# EAGLE design pci_fonte (EAGLE 9.6.2)
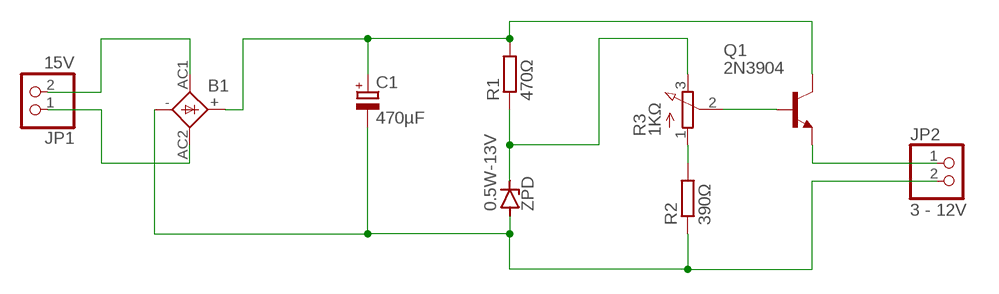
[diagram p0: schematic, sheet 1]

## Parts
0.5W-13V  ZPD  [DO35Z10]
B1  1KAB  [1KAB]
C1  470µF  CPOL-EUE3.5-10  [E3,5-10]
JP1  15V  PINHD-1X2  [1X02]
JP2  3 - 12V  PINHD-1X2  [1X02]
Q1  2N3904  [TO92]
R1  470Ω  R-EU_0204/7  [0204/7]
R2  390Ω  R-EU_0204/7  [0204/7]
R3  1KΩ  3RP/1610N  [3RP/1610N]

## Nets
N$1: B1.AC1 JP1.2
N$2: B1.AC2 JP1.1
N$3: B1.+ C1.+ Q1.1(C) R1.2
N$5: Q1.2(B) R3.2(S)
N$6: 0.5W-13V.C R1.1 R3.3(E)
N$7: JP2.1 Q1.3(E)
N$8: R2.2 R3.1(A)
N$9: 0.5W-13V.A B1.- C1.- JP2.2 R2.1

## Library data of the parts
0.5W-13V = diode:ZPD: Z DIODE 500 mW
B1 = rectifier:1KAB: RECTIFIER grid 5,08 x 5,08 mm
C1 = rcl:CPOL-EU: POLARIZED CAPACITOR, European symbol; SPICEPREFIX: C
JP1 JP2 = pinhead:PINHD-1X2: PIN HEADER
Q1 = transistor-npn:2N3904: NPN Transistor
R1 R2 = rcl:R-EU_: RESISTOR, European symbol; SPICEPREFIX: R
R3 = pot:3RP/1610N: 16mm Potentiometer one level Source: http://www.alphapotentiometers.net/html/16mm_pot_2.html

## Board
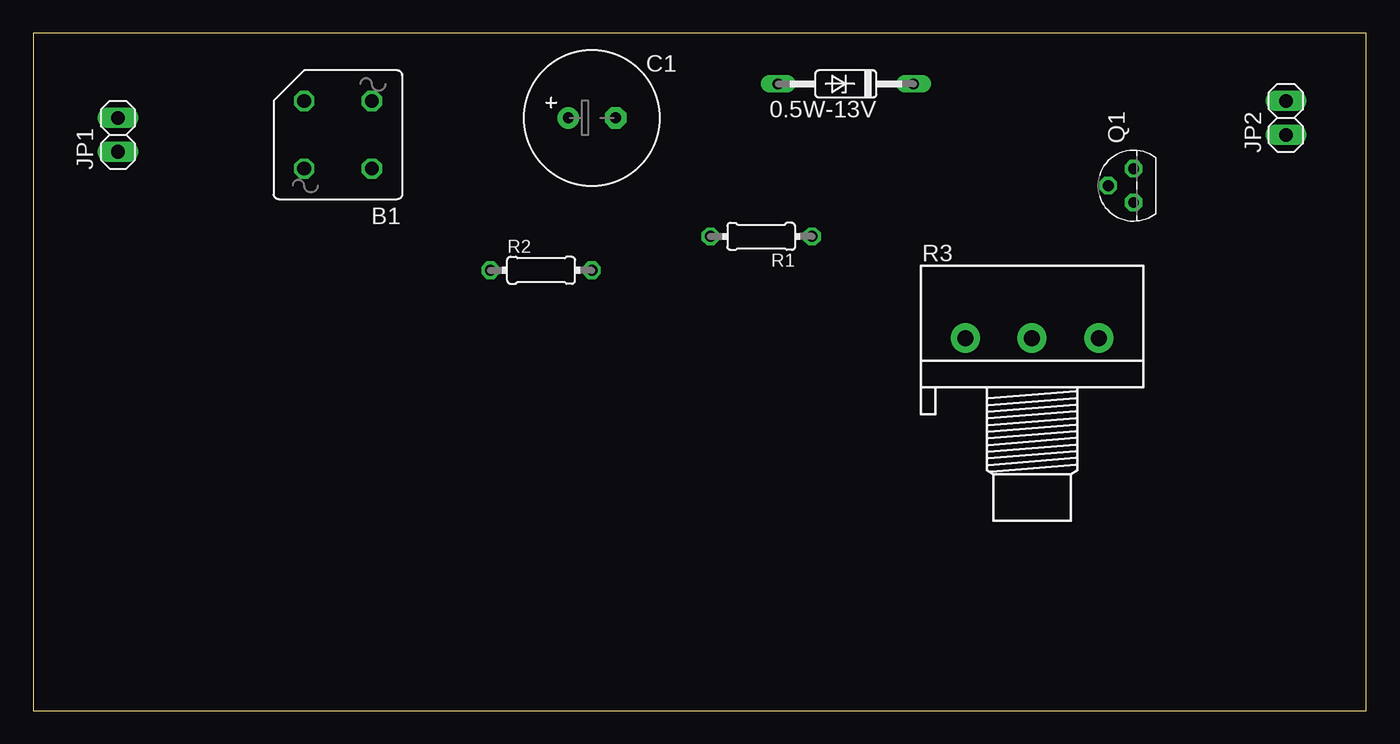
[diagram p1: board, top side]
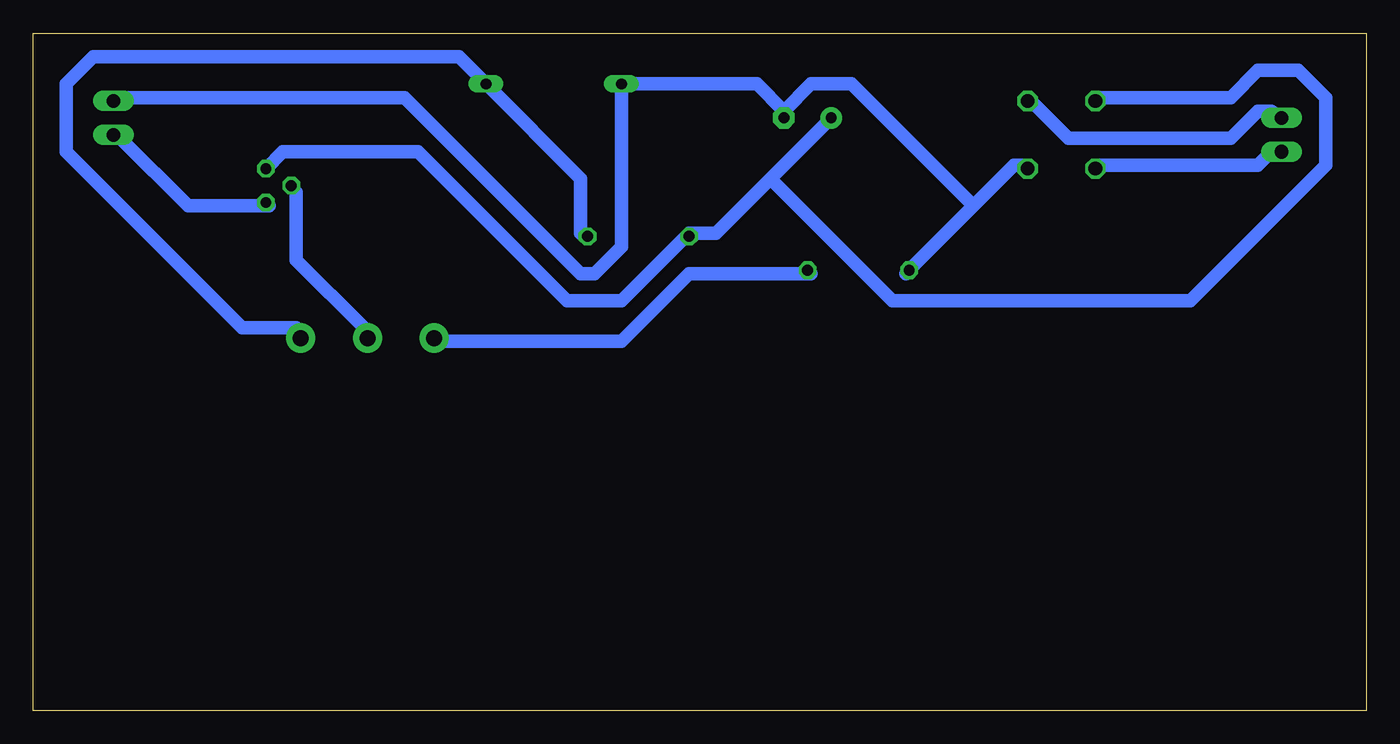
[diagram p2: board, bottom side, seen from below]

Size 100 x 50.79 mm. Coordinates in mm from the lower left corner, seen from the top.
Outline: 0,0 100,0 100,50.79 0,50.79 0,0
Copper layers (1*16): Top 0.035mm / dielectric 1.5mm / Bottom 0.035mm
Design rules "default *": minimum track width 40mil, minimum drill 0.35mm, track to track 40mil, track to pad 40mil, pad to pad 40mil, via to via 40mil, smd to smd 6mil, copper to edge 40mil, drill to drill 6mil, minimum pad ring 10mil, minimum via ring 8mil, stop-mask expansion 4mil, vias tented up to drill 0mil, thermal gap 10mil

### Footprints (pad centres in the part's own frame; a part is rotated, then mirrored left to right if it is on the bottom)
DO35Z10 = drill 0.813 long: A 5.08,0; C -5.08,0
1KAB = drill 1.016 octagon: + 2.54,-2.54; - -2.54,2.54; AC1 -2.54,-2.54; AC2 2.54,2.54
E3,5-10 = drill 0.813 pad 1.6: + -1.778,0 | drill 0.813 pad 1.6 octagon: - 1.778,0
1X02 = drill 1.016 long: 1 -1.27,0; 2 1.27,0
TO92 = drill 0.813 octagon: 1 1.27,0; 2 0,1.905; 3 -1.27,0
0204/7 = drill 0.813 octagon: 1 -3.81,0; 2 3.81,0
3RP/1610N = drill 1.2 pad 2.184: 1 -5,0; 2 0,0; 3 5,0

### Placement (x,y rotation side)
0.5W-13V  60.96,46.99 180 top
B1  22.86,43.18 180 top
C1  41.91,44.45 0 top
JP1  6.35,43.18 90 top
JP2  93.98,44.45 90 top
Q1  82.55,39.37 90 top
R1  54.61,35.56 180 top
R2  38.1,33.02 0 top
R3  74.93,27.94 0 top

### Tracks (layer width: path | path; a pad name or v marks a point on that pad's centre or on a via)
N$1
  Bottom 1.016: JP1.2 7.11,44.96 8.13,44.96 10.16,42.93 22.35,42.93 25.4,45.97 B1.AC1
N$2
  Bottom 1.016: B1.AC2 20.32,40.89 8.13,40.89 7.11,41.91 JP1.1
N$3
  Bottom 1.016: 50.8,35.81 48.77,35.81 44.7,39.88 | C1.+ 44.7,39.88 | Q1.1 81.28,41.91 71.12,41.91 59.94,30.73 55.88,30.73 50.8,35.81 | 50.8,35.81 R1.2 | 44.7,39.88 35.56,30.73 13.21,30.73 3.05,40.89 3.05,45.97 5.08,48.01 8.13,48.01 10.16,45.97 20.32,45.97 B1.+
N$5
  Bottom 1.016: Q1.2 80.26,38.86 80.26,33.78 75.18,28.7 R3.2
N$6
  Bottom 1.016: R1.1 58.93,35.81 58.93,39.88 0.5W-13V.C 68.07,49.02 95.5,49.02 97.54,46.99 97.54,41.91 84.33,28.7 80.26,28.7 R3.3
N$7
  Bottom 1.016: Q1.3 82.3,37.85 88.39,37.85 93.47,42.93 JP2.1
N$8
  Bottom 1.016: R2.2 41.66,32.77 50.8,32.77 55.88,27.69 69.09,27.69 R3.1
N$9
  Bottom 1.016: 29.46,37.85 26.42,40.89 25.4,40.89 B1.- | 29.46,37.85 R2.1 34.54,32.77 | 43.69,44.96 45.72,46.99 0.5W-13V.A 55.88,34.8 57.91,32.77 58.93,32.77 72.14,45.97 93.47,45.97 JP2.2 | 29.46,37.85 38.61,46.99 41.66,46.99 43.69,44.96 | 43.69,44.96 C1.-